# EAGLE design Toyota_AutoSwitch_Giraffe (EAGLE 8.3.2)
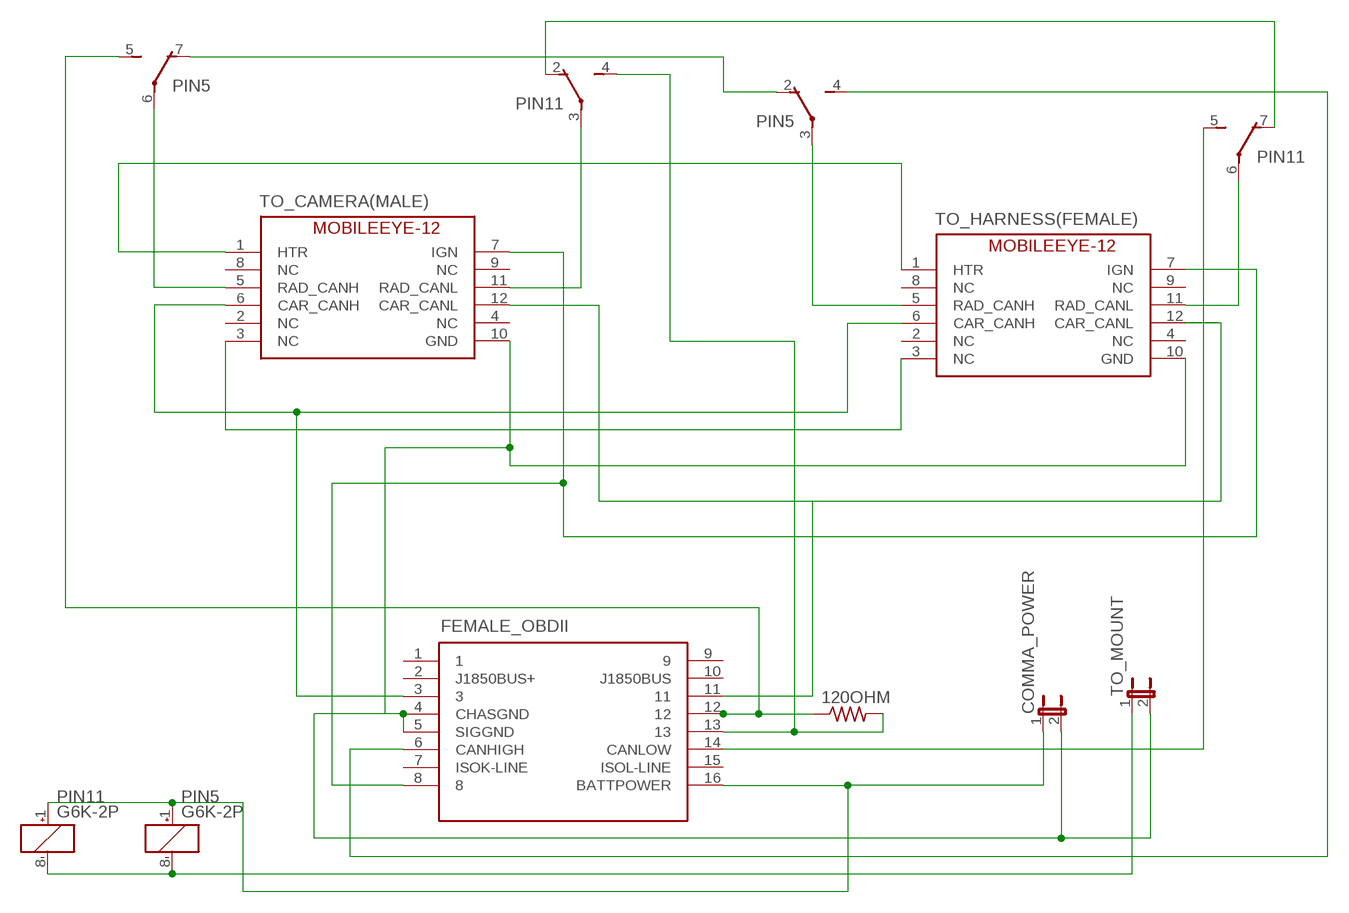
[diagram p0: schematic, sheet 1]

## Parts
120OHM  R-US_0204/7  [0204/7]
COMMA_POWER  JP1E  [JP1]
FEMALE_OBDII  OBDIIFEMALE  [OBDII-FEMALE]
PIN5  G6K-2P  [G6K-2P]
PIN11  G6K-2P  [G6K-2P]
TO_CAMERA(MALE)  MOBILEEYE-12FEMALE  [2X6-TE-FEMALE]
TO_HARNESS(FEMALE)  MOBILEEYE-12FEMALE  [2X6-TE-FEMALE]
TO_MOUNT  JP1E  [JP1]

## Nets
N$1: TO_CAMERA(MALE).1(HTR) TO_HARNESS(FEMALE).1(HTR)
N$2: TO_CAMERA(MALE).3(NC) TO_HARNESS(FEMALE).3(NC)
N$3: PIN5.6(3:P) TO_CAMERA(MALE).5(RAD_CANH)
N$4: COMMA_POWER.2 FEMALE_OBDII.4(CHASGND) FEMALE_OBDII.5(SIGGND) TO_CAMERA(MALE).10(GND) TO_HARNESS(FEMALE).10(GND) TO_MOUNT.2
N$5: 120OHM.1 FEMALE_OBDII.12 PIN5.5(3:S)
N$6: 120OHM.2 FEMALE_OBDII.13 PIN11.4(2:S)
N$7: PIN5.2(2:O) PIN5.7(3:O)
N$8: FEMALE_OBDII.11 TO_CAMERA(MALE).12(CAR_CANL) TO_HARNESS(FEMALE).12(CAR_CANL)
N$9: FEMALE_OBDII.3 TO_CAMERA(MALE).6(CAR_CANH) TO_HARNESS(FEMALE).6(CAR_CANH)
N$10: FEMALE_OBDII.8 TO_CAMERA(MALE).7(IGN) TO_HARNESS(FEMALE).7(IGN)
N$11: PIN11.3(2:P) TO_CAMERA(MALE).11(RAD_CANL)
N$12: FEMALE_OBDII.6(CANHIGH) PIN5.4(2:S)
N$13: COMMA_POWER.1 FEMALE_OBDII.16(BATTPOWER) PIN5.1(1:+) PIN11.1(1:+)
N$14: PIN11.6(3:P) TO_HARNESS(FEMALE).11(RAD_CANL)
N$15: PIN5.8(1:-) PIN11.8(1:-) TO_MOUNT.1
N$16: PIN11.2(2:O) PIN11.7(3:O)
N$17: PIN5.3(2:P) TO_HARNESS(FEMALE).5(RAD_CANH)
N$19: FEMALE_OBDII.14(CANLOW) PIN11.5(3:S)
Unconnected: FEMALE_OBDII.1 FEMALE_OBDII.2(J1850BUS+) FEMALE_OBDII.7(ISOK-LINE) FEMALE_OBDII.9 FEMALE_OBDII.10(J1850BUS) FEMALE_OBDII.15(ISOL-LINE) TO_CAMERA(MALE).2(NC) TO_CAMERA(MALE).4(NC) TO_CAMERA(MALE).8(NC) TO_CAMERA(MALE).9(NC) TO_HARNESS(FEMALE).2(NC) TO_HARNESS(FEMALE).4(NC) TO_HARNESS(FEMALE).8(NC) TO_HARNESS(FEMALE).9(NC)

## Library data of the parts
120OHM = resistor:R-US_: RESISTOR, American symbol
COMMA_POWER TO_MOUNT = jumper:JP1E: JUMPER
FEMALE_OBDII = comma.ai:OBDII: OBDII connector footprint; OC_NEWARK: unknown
PIN5 PIN11 = relay:G6K: Low Signal Relay oeiwcsnts1.omron.com/.. D20G6K0100.pdf; MF: OMRON COMPONENTS USA; MPN: G6K-2P DC3; OC_FARNELL: 3937276; OC_NEWARK: 89C6482
TO_CAMERA(MALE) TO_HARNESS(FEMALE) = comma.ai:MOBILEEYE-12; OC_NEWARK: unknown

## Board
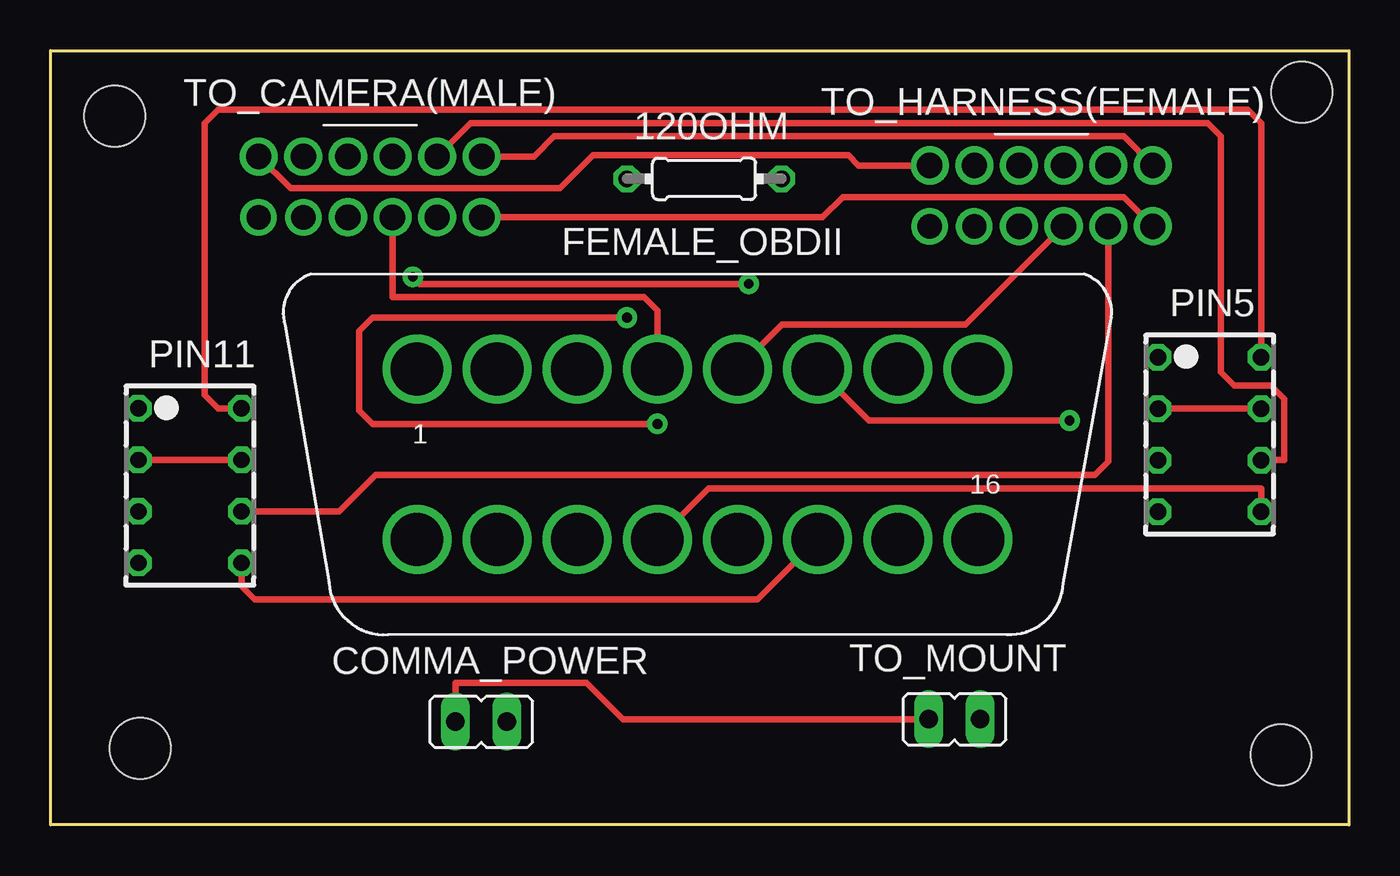
[diagram p1: board, top side]
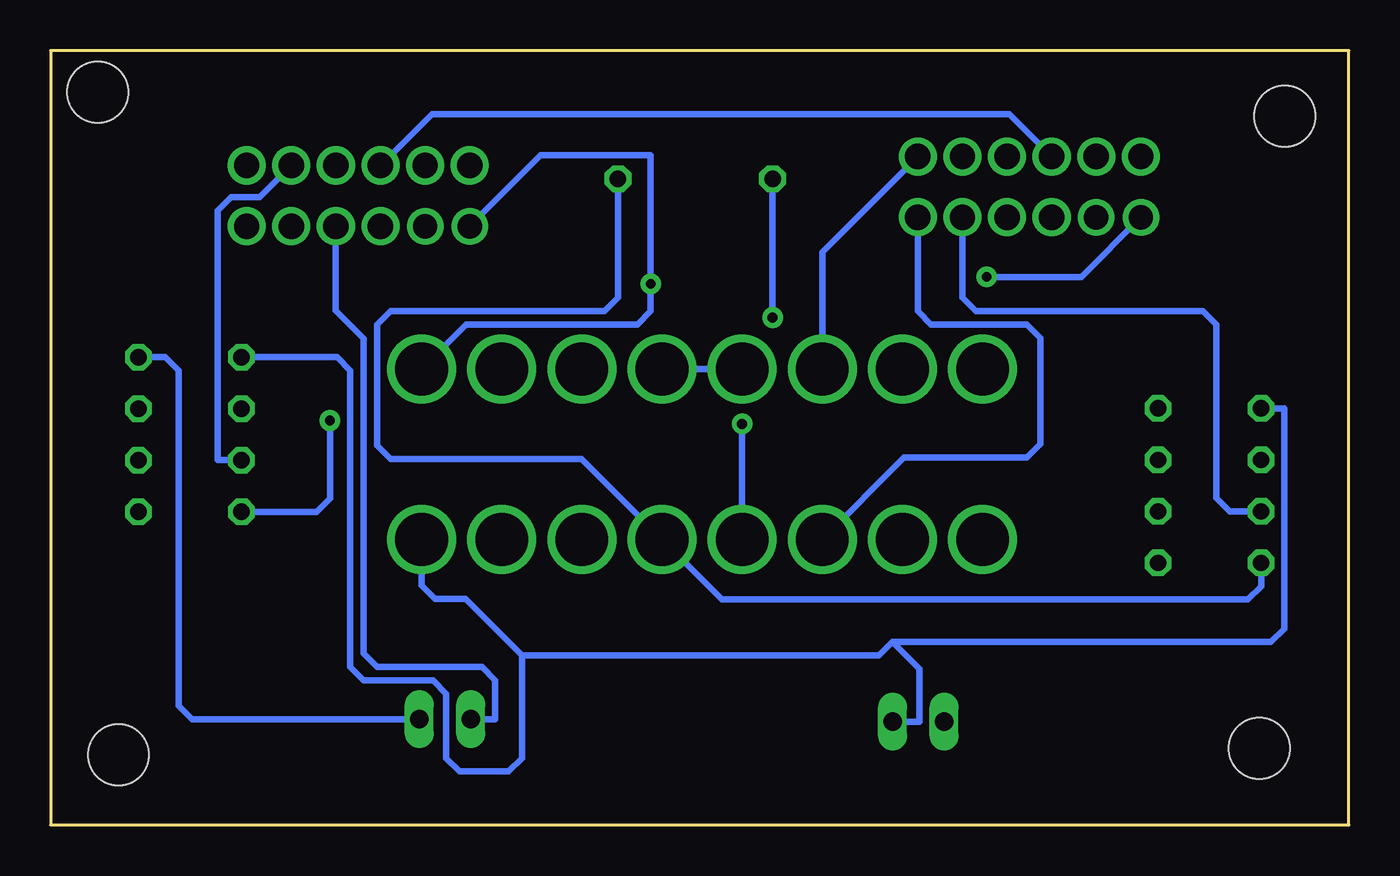
[diagram p2: board, bottom side, seen from below]

Size 63.98 x 38.17 mm. Coordinates in mm from the lower left corner, seen from the top.
Outline: 0,38.17 63.98,38.17 63.98,0 0,0 0,38.17
Copper layers (1*16): Top 0.035mm / dielectric 1.5mm / Bottom 0.035mm
Design rules "default *": minimum track width 10mil, minimum drill 0.61mm, track to track 8mil, track to pad 8mil, pad to pad 8mil, via to via 8mil, smd to smd 8mil, copper to edge 40mil, drill to drill 8mil, minimum pad ring 0mil, minimum via ring 8mil, stop-mask expansion 4mil, vias tented up to drill 19mil, thermal gap 10mil
Holes 3 mm at 3.15,34.94 4.41,3.78 60.65,3.45 61.66,36.12

### Footprints (pad centres in the part's own frame; a part is rotated, then mirrored left to right if it is on the bottom)
0204/7 = drill 0.813 pad 1.321 octagon: 1 -3.81,0; 2 3.81,0
JP1 = drill 0.914 pad 1.422 long: 1 0,-1.27; 2 0,1.27
OBDII-FEMALE = drill 2.6 pad 3.4: 1 13.825,-4.2; 2 9.875,-4.2; 3 5.925,-4.2; 4 1.975,-4.2; 5 -1.975,-4.2; 6 -5.925,-4.2; 7 -9.875,-4.2; 8 -13.825,-4.2; 9 13.825,4.2; 10 9.875,4.2; 11 5.925,4.2; 12 1.975,4.2; 13 -1.975,4.2; 14 -5.925,4.2; 15 -9.875,4.2; 16 -13.825,4.2
G6K-2P = drill 0.8 pad 1.308 octagon: 1 -2.54,-2.54; 2 0,-2.54; 3 2.54,-2.54; 4 5.08,-2.54; 5 5.08,2.54; 6 2.54,2.54; 7 0,2.54; 8 -2.54,2.54
2X6-TE-FEMALE = drill 1.25 pad 1.875: 1 -5.5,1.5; 2 -3.3,1.5; 3 -1.1,1.5; 4 1.1,1.5; 5 3.3,1.5; 6 5.5,1.5; 9 -1.1,-1.5; 10 1.1,-1.5; 11 3.3,-1.5; 12 5.5,-1.5 | drill 1.2 pad 1.8: 7 -5.5,-1.5; 8 -3.3,-1.5

### Placement (x,y rotation side)
120OHM  R-US_0204/7 (R-US_)  [0204/7]  32.21,31.85 0 top
COMMA_POWER  JP1E  [JP1]  21.22,5.09 90 top
FEMALE_OBDII  OBDIIFEMALE (OBDII)  [OBDII-FEMALE]  31.88,18.27 180 top
PIN5  G6K-2P (G6K)  [G6K-2P]  57.12,20.52 270 top
PIN11  G6K-2P (G6K)  [G6K-2P]  6.86,18 270 top
TO_CAMERA(MALE)  MOBILEEYE-12FEMALE (MOBILEEYE-12)  [2X6-TE-FEMALE]  15.75,31.45 0 top
TO_HARNESS(FEMALE)  MOBILEEYE-12FEMALE (MOBILEEYE-12)  [2X6-TE-FEMALE]  48.83,31.01 0 top
TO_MOUNT  JP1E  [JP1]  44.55,5.21 90 top

### Tracks (layer width: path | path; a pad name or v marks a point on that pad's centre or on a via)
N$1
  Top 0.33: TO_CAMERA(MALE).1 11.81,31.39 25.12,31.39 26.74,33.01 39.31,33.01 39.81,32.51 TO_HARNESS(FEMALE).1
N$2
  Bottom 0.33: TO_HARNESS(FEMALE).3 45.19,35.05 16.74,35.05 TO_CAMERA(MALE).3
N$3
  Top 0.33: TO_CAMERA(MALE).5 20.7,34.61 57.02,34.61 57.68,33.95 57.68,22.33 58.34,21.67 60.15,21.67 60.81,21.01 60.81,17.98 PIN5.6
N$4
  Top 0.33: FEMALE_OBDII.5 36.05,24.67 45.08,24.67 TO_HARNESS(FEMALE).10 | FEMALE_OBDII.4 29.9,25.35 29.24,26.01 16.85,26.01 TO_CAMERA(MALE).10 | TO_MOUNT.2 28.21,5.21 26.42,7.01 19.95,7.01 COMMA_POWER.2
  Bottom 0.33: TO_HARNESS(FEMALE).10 49.93,25.35 48.56,23.98 48.56,8.45 47.9,7.79 42.73,7.79 42.07,7.13 42.07,5.21 TO_MOUNT.2 | FEMALE_OBDII.5 FEMALE_OBDII.4
N$5  (via drill 0.49 pad 1.02)
  Top 0.33: FEMALE_OBDII.12 32.42,16.59 59.66,16.59 PIN5.5 | v28.4,25.01 15.86,25.01 15.2,24.35 15.2,20.43 15.86,19.77 v29.9,19.77
  Bottom 0.33: FEMALE_OBDII.12 v29.9,19.77 | 120OHM.1 v28.4,25.01
N$6
  Bottom 0.33: PIN11.4 4.32,11.77 4.98,11.11 30.89,11.11 FEMALE_OBDII.13 37.83,18.05 47.24,18.05 47.9,18.71 47.9,24.67 47.24,25.33 36.68,25.33 36.02,25.99 120OHM.2
N$7
  Top 0.33: PIN5.7 PIN5.2
N$8
  Top 0.33: TO_CAMERA(MALE).12 38.05,29.95 39.04,30.95 52.9,30.95 TO_HARNESS(FEMALE).12
  Bottom 0.33: TO_CAMERA(MALE).12 21.25,25.33 20.59,24.67 15.86,24.67 15.2,24.01 15.2,18.77 15.86,18.11 21.92,18.11 FEMALE_OBDII.11
N$9
  Top 0.33: TO_CAMERA(MALE).6 23.82,32.95 24.81,33.95 52.9,33.95 TO_HARNESS(FEMALE).6
  Bottom 0.33: TO_CAMERA(MALE).6 25.95,28.25 FEMALE_OBDII.3
N$10  (via drill 0.49 pad 1.02)
  Top 0.33: v17.85,27.02 18.19,26.67 v34.41,26.67
  Bottom 0.33: FEMALE_OBDII.8 43.51,24.67 35.07,24.67 34.41,25.33 v34.41,26.67 34.41,33.01 39.83,33.01 TO_HARNESS(FEMALE).7 | v17.85,27.02 13.18,27.02 TO_CAMERA(MALE).7
N$11
  Bottom 0.33: TO_CAMERA(MALE).11 19.05,25.99 18.39,25.33 7.18,25.33 6.52,24.67 6.52,16.12 5.86,15.46 PIN11.3
N$12  (via drill 0.49 pad 1.02)
  Top 0.33: v50.22,19.93 40.34,19.93 FEMALE_OBDII.6
  Bottom 0.33: v50.22,19.93 50.22,16.1 50.88,15.44 PIN5.4
N$13
  Bottom 0.33: PIN5.1 49.88,23.06 49.22,22.4 49.22,7.79 48.56,7.13 45.14,7.13 44.48,6.47 44.48,3.29 43.83,2.63 41.41,2.63 40.75,3.29 40.75,8.35 | 40.75,8.35 23.15,8.35 22.49,9.01 | 22.49,9.01 3.83,9.01 3.17,9.67 3.17,20.54 PIN11.1 | 40.75,8.35 43.53,11.13 45.04,11.13 45.7,11.79 FEMALE_OBDII.16 | 22.49,9.01 21.15,7.68 21.15,5.09 COMMA_POWER.1
N$14
  Top 0.33: PIN11.6 14.21,15.46 16,17.25 51.47,17.25 52.13,17.91 TO_HARNESS(FEMALE).11
N$15
  Top 0.33: PIN5.8 59.66,34.61 59,35.27 8.25,35.27 7.59,34.61 7.59,21.2 8.25,20.54 PIN11.8
  Bottom 0.33: PIN5.8 58.34,23.06 57.68,22.4 57.68,5.87 57.02,5.21 TO_MOUNT.1
N$16
  Top 0.33: PIN11.7 7.5,18 | 7.5,18 | 7.5,18 PIN11.2
N$17
  Bottom 0.33: TO_HARNESS(FEMALE).5 53.7,30.95 55.1,30.95 55.76,30.29 55.76,17.98 PIN5.3
N$19
  Top 0.33: FEMALE_OBDII.14 34.84,11.11 10.06,11.11 9.4,11.77 PIN11.5